# Altium schematic sheet ExternalConnections.SchDoc
size B; SheetNumber: 5; SheetTotal: 6
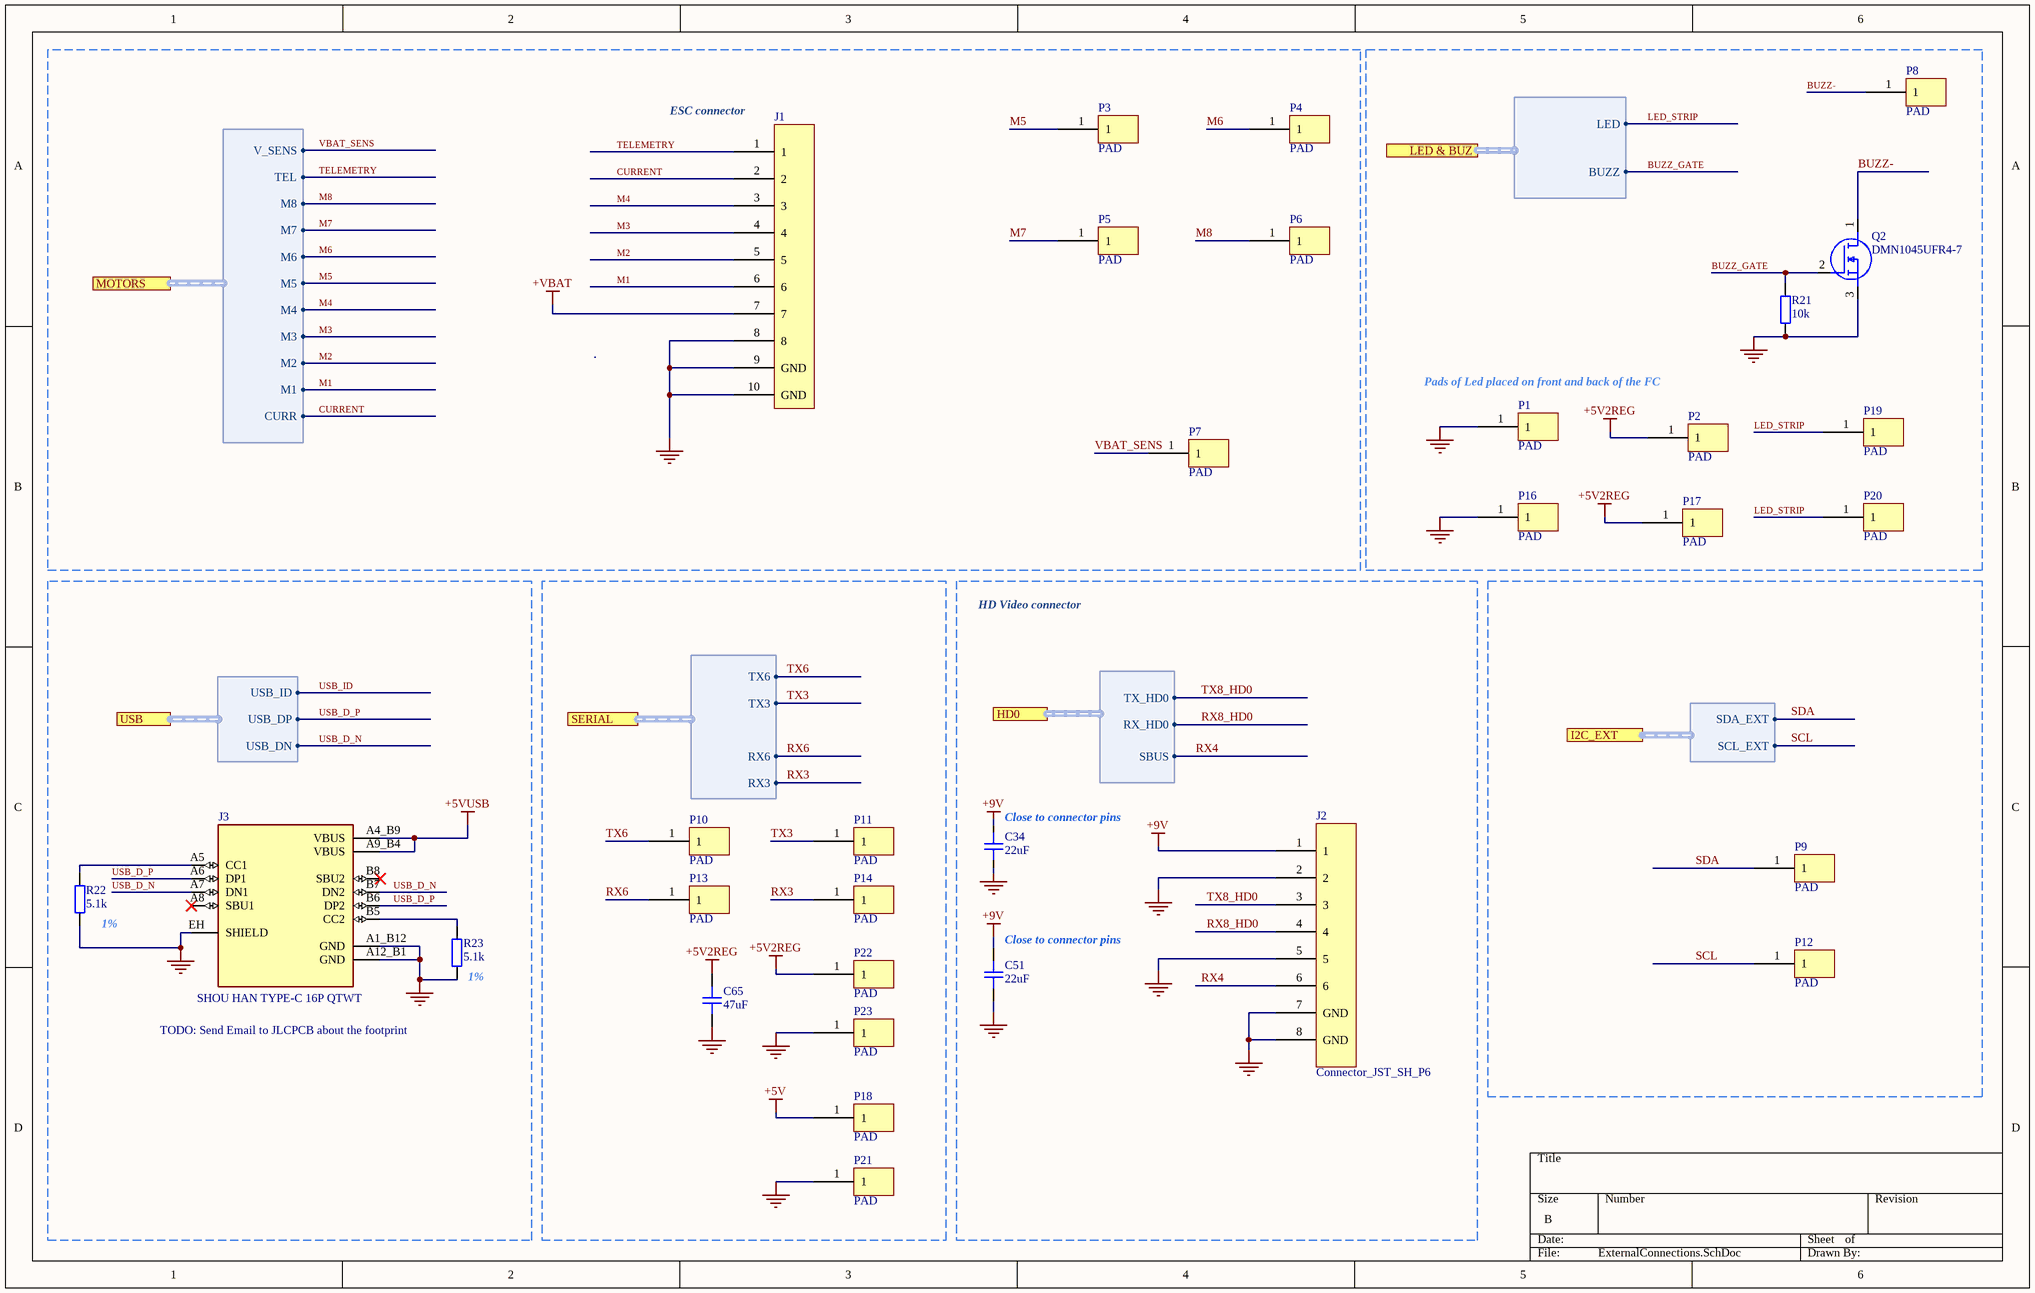
[diagram p0: ExternalConnections.SchDoc]

## Parts
C34  22uF  [CAP_0603]
C51  22uF  [CAP_0603]
C65  47uF  [CAP_0603]
J1  Connector_JST_SH_P8  [Connector_JST_SH_P8]  (value not drawn)
J2  Connector_JST_SH_P6  [Connector_JST_SH_P6]
J3  SHOU HAN TYPE-C 16P QTWT  [USBC_NoHolse]
P1  PAD  [PAD]
P2  PAD  [PAD]
P3  PAD  [PAD]
P4  PAD  [PAD]
P5  PAD  [PAD]
P6  PAD  [PAD]
P7  PAD  [PAD]
P8  PAD  [PAD]
P9  PAD  [PAD]
P10  PAD  [PAD]
P11  PAD  [PAD]
P12  PAD  [PAD]
P13  PAD  [PAD]
P14  PAD  [PAD]
P16  PAD  [PAD]
P17  PAD  [PAD]
P18  PAD  [PAD]
P19  PAD  [PAD]
P20  PAD  [PAD]
P21  PAD  [PAD]
P22  PAD  [PAD]
P23  PAD  [PAD]
Q2  DMN1045UFR4-7  [DMP1200UFR47]
R21  10k  [RES_0201]
R22  5.1k  [RES_0201]
R23  5.1k  [RES_0201]

## Blocks framed on the sheet
ESC connector: J1 P3-P7
Pads of Led placed on front and back of the FC: P1 P2 P8 P16 P17 P19 P20 Q2 R21

## Ports
HD0 (harness HD0, see Overview[3A], MCU[8B]), I2C_EXT (harness I2C_EXT, see Overview[3B], MCU[1C]), LED & BUZ (harness LED_BUZZ, see Overview[3B], MCU[8C]), MOTORS (harness MOTORS, see Overview[3A], MCU[1B]), SERIAL (harness SERIAL, see Overview[3A], MCU[8B]), USB (harness USB, see Overview[3A], MCU[8B])

## Harnesses
MOTORS: CURR, M1, M2, M3, M4, M5, M6, M7, M8, TEL, V_SENS
USB: USB_DN, USB_DP, USB_ID
I2C_EXT: SCL_EXT, SDA_EXT
SERIAL: RX3, RX6, TX3, TX6
HD0: RX_HD0, TX_HD0, SBUS
LED_BUZZ: LED, BUZZ

## Nets
+5V: P18.1
+5V2REG: C65.1 P2.1 P17.1 P22.1
+5VUSB: J3.A4_B9(VBUS) J3.A9_B4(VBUS)
+9V: C34.1 C51.1 J2.1
+VBAT: J1.7
GND: C34.2 C51.2 C65.2 J1.8 J1.9(GND) J1.10(GND) J2.2 J2.5 J2.7(GND) J2.8(GND) J3.A1_B12(GND) J3.A12_B1(GND) J3.EH(SHIELD) P1.1 P16.1 P21.1 P23.1 Q2.3(S) R21.1 R22.1 R23.1
BUZZ-: P8.1 Q2.1(D)
BUZZ_GATE: Q2.2(G) R21.2 ; port LED & BUZ.BUZZ
CURRENT: J1.2 ; port MOTORS.CURR
LED_STRIP: P19.1 P20.1 ; port LED & BUZ.LED
M1: J1.6 ; port MOTORS.M1
M2: J1.5 ; port MOTORS.M2
M3: J1.4 ; port MOTORS.M3
M4: J1.3 ; port MOTORS.M4
M5: P3.1 ; port MOTORS.M5
M6: P4.1 ; port MOTORS.M6
M7: P5.1 ; port MOTORS.M7
M8: P6.1 ; port MOTORS.M8
RX3: P14.1 ; port SERIAL.RX3
RX4: J2.6 ; port HD0.SBUS
RX6: P13.1 ; port SERIAL.RX6
RX8_HD0: J2.4 ; port HD0.RX_HD0
SCL: P12.1 ; port I2C_EXT.SCL_EXT
SDA: P9.1 ; port I2C_EXT.SDA_EXT
TELEMETRY: J1.1 ; port MOTORS.TEL
TX3: P11.1 ; port SERIAL.TX3
TX6: P10.1 ; port SERIAL.TX6
TX8_HD0: J2.3 ; port HD0.TX_HD0
USB_D_N: J3.A7(DN1) J3.B7(DN2) ; port USB.USB_DN
USB_D_P: J3.A6(DP1) J3.B6(DP2) ; port USB.USB_DP
USB_ID: port USB.USB_ID
VBAT_SENS: P7.1 ; port MOTORS.V_SENS
NetJ3_A5: J3.A5(CC1) R22.2
NetJ3_B5: J3.B5(CC2) R23.2

Not connected (* = marked no-connect by the designer): J3 A8(SBU1)* B8(SBU2)*

## Notes on the sheet
- HD Video connector
- (near C34) Close to connector pins
- (near R22) 1%
- (near C51) Close to connector pins
- TODO: Send Email to JLCPCB about the footprint
- (near R23) 1%

## Library data of the parts
C34 C51 C65 = CAP_0603: Capacitor SMD 0603; Manufacturer: *; Manufacturer Part Number: *; Distributor Link: *; LCSC: *; Rating: *; Dielectric: *
Q2 = DMN1045UFR4-7: MOSFET (N-Channel); Manufacturer_Name: Diodes Incorporated; Datasheet Link: https://www.diodes.com//assets/Datasheets/DMN1045UFR4.pdf; Manufacturer_Part_Number: DMN1045UFR4-7; Mouser Part Number: 621-DMN1045UFR4-7; Mouser Price/Stock: https://www.mouser.co.uk/ProductDetail/Diodes-Incorporated/DMN1045UFR4-7?qs=OVC8WVYZliTSRHekNl8zHg%3D%3D; Arrow Part Number: DMN1045UFR4-7; Arrow Price/Stock: https://www.arrow.com/en/products/dmn1045ufr4-7/diodes-incorporated
R21-R23 = RES_0201: Resistor SMD 0201; Manufacturer: *; Manufacturer Part Number: *; Distributor Link: *; LCSC: *
J1 = Connector_JST_SH_P8: LCSC Part #: C3041142
J2 = Connector_JST_SH_P6: LCSC Part #: C3041141
J3 = SHOU HAN TYPE-C 16P QTWT: LCSC Part #: C5187472; Mfr. Part #: TYPE-C 16P QTWT; Datasheet: https://www.lcsc.com/datasheet/lcsc_datasheet_2209291730_SHOU-HAN-TYPE-C-16P-QTWT_C5187472.pdf; Manufacturer: SHOU HAN